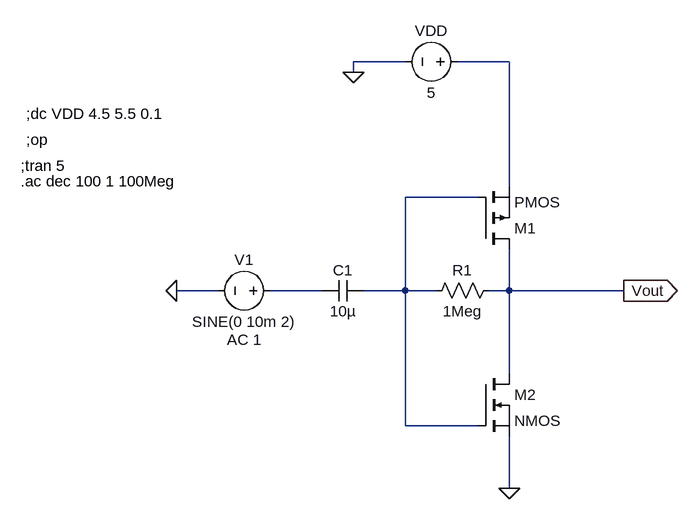
[diagram p0: schematic Inverter.asc]
Inverter.asc, the LTspice schematic file:
Version 4
SHEET 1 880 680
WIRE 144 -240 64 -240
WIRE 304 -240 224 -240
WIRE 64 -224 64 -240
WIRE 304 -48 304 -240
WIRE 256 -32 144 -32
WIRE -144 112 -208 112
WIRE 16 112 -64 112
WIRE 144 112 144 -32
WIRE 144 112 80 112
WIRE 192 112 144 112
WIRE 304 112 304 48
WIRE 304 112 272 112
WIRE 480 112 304 112
WIRE 304 240 304 112
WIRE 144 320 144 112
WIRE 256 320 144 320
WIRE 304 416 304 336
FLAG 64 -224 0
FLAG 304 416 0
FLAG 480 112 Vout
IOPIN 480 112 Out
FLAG -208 112 0
SYMBOL voltage -48 112 R90
WINDOW 0 -32 56 VBottom 2
WINDOW 3 32 56 VTop 2
WINDOW 123 60 56 VTop 2
WINDOW 39 0 0 Left 0
SYMATTR InstName V1
SYMATTR Value SINE(0 10m 2)
SYMATTR Value2 AC 1
SYMBOL pmos 256 48 M180
SYMATTR InstName M1
SYMBOL nmos 256 240 R0
SYMATTR InstName M2
SYMBOL voltage 240 -240 R90
WINDOW 0 -32 56 VBottom 2
WINDOW 3 32 56 VTop 2
WINDOW 123 0 0 Left 0
WINDOW 39 0 0 Left 0
SYMATTR InstName VDD
SYMATTR Value 5
SYMBOL cap 80 96 R90
WINDOW 0 0 32 VBottom 2
WINDOW 3 32 32 VTop 2
SYMATTR InstName C1
SYMATTR Value 10µ
SYMBOL res 288 96 R90
WINDOW 0 0 56 VBottom 2
WINDOW 3 32 56 VTop 2
SYMATTR InstName R1
SYMATTR Value 1Meg
TEXT -448 -80 Left 2 !;tran 5
TEXT -440 -160 Left 2 !;dc VDD 4.5 5.5 0.1
TEXT -440 -120 Left 2 !;op
TEXT -448 -56 Left 2 !.ac dec 100 1 100Meg

The netlist it stands for:
* Inverter.asc
V1 N003 0 SINE(0 10m 2) AC 1
M1 Vout N002 N001 N001 PMOS
M2 Vout N002 0 0 NMOS
VDD N001 0 5
C1 N002 N003 10µ
R1 Vout N002 1Meg
.model NMOS NMOS
.model PMOS PMOS
.lib standard.mos
;tran 5
;dc VDD 4.5 5.5 0.1
;op
.ac dec 100 1 100Meg
.backanno
.end